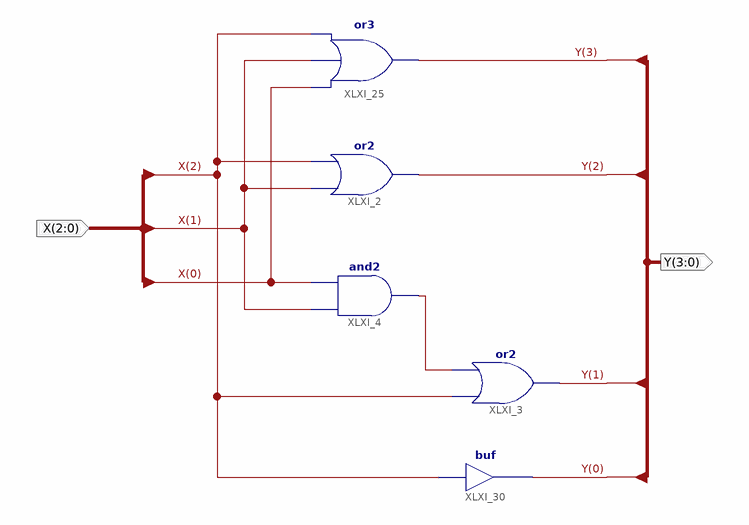
[diagram p0: schematic sheet 1]
// Xilinx ISE schematic stardecoder.sch (spartan6) as structural Verilog: 5 symbols, 2 ports
module stardecoder (
  input  [2:0] X,
  output [3:0] Y
);

  wire XLXN_1;

  and XLXI_4 (XLXN_1, X[1], X[0]);
  or XLXI_3 (Y[1], X[2], XLXN_1);
  or XLXI_25 (Y[3], X[0], X[1], X[2]);
  or XLXI_2 (Y[2], X[1], X[2]);
  buf XLXI_30 (Y[0], X[2]);
endmodule
